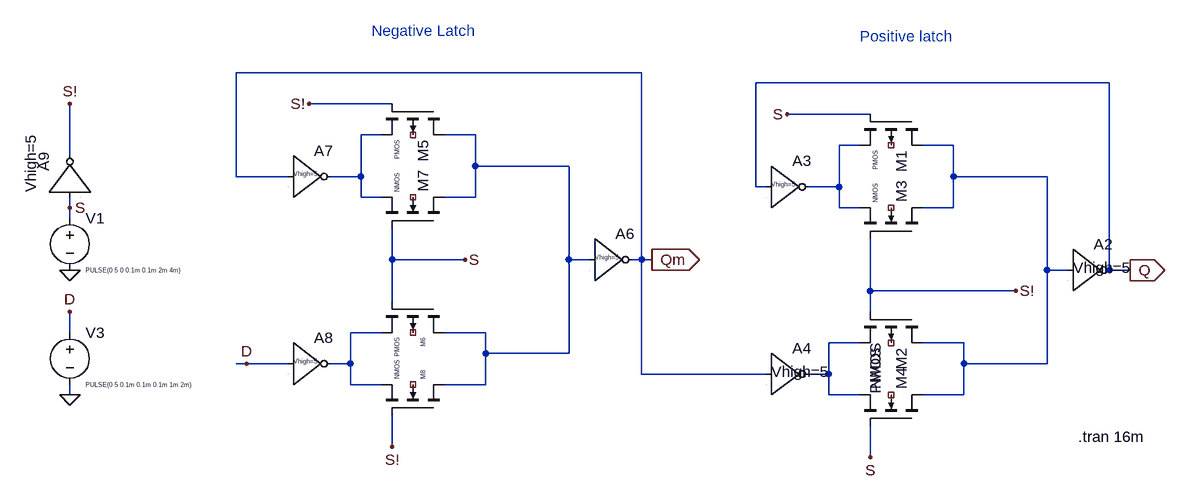
[diagram p0: schematic master_slave_rn.asc]
master_slave_rn.asc, the LTspice schematic file:
Version 4
SHEET 1 2536 680
WIRE 1040 -192 416 -192
WIRE 1760 -176 1216 -176
WIRE 656 -144 528 -144
WIRE 1392 -128 1264 -128
WIRE 640 -96 608 -96
WIRE 784 -96 736 -96
WIRE 1376 -80 1344 -80
WIRE 1520 -80 1472 -80
WIRE 160 -64 160 -144
WIRE 784 -48 784 -96
WIRE 928 -48 784 -48
WIRE 416 -32 416 -192
WIRE 496 -32 416 -32
WIRE 608 -32 608 -96
WIRE 608 -32 560 -32
WIRE 1520 -32 1520 -80
WIRE 1664 -32 1520 -32
WIRE 1216 -16 1216 -176
WIRE 1232 -16 1216 -16
WIRE 1344 -16 1344 -80
WIRE 1344 -16 1296 -16
WIRE 608 0 608 -32
WIRE 640 0 608 0
WIRE 784 0 784 -48
WIRE 784 0 736 0
WIRE 160 16 160 0
WIRE 1344 16 1344 -16
WIRE 1376 16 1344 16
WIRE 1520 16 1520 -32
WIRE 1520 16 1472 16
WIRE 160 32 160 16
WIRE 656 96 656 48
WIRE 768 96 656 96
WIRE 928 96 928 -48
WIRE 960 96 928 96
WIRE 1040 96 1040 -192
WIRE 1040 96 1024 96
WIRE 1056 96 1040 96
WIRE 1664 112 1664 -32
WIRE 1696 112 1664 112
WIRE 1760 112 1760 -176
WIRE 1792 112 1760 112
WIRE 1392 144 1392 64
WIRE 1616 144 1392 144
WIRE 656 160 656 96
WIRE 1392 176 1392 144
WIRE 160 208 160 176
WIRE 640 208 592 208
WIRE 800 208 736 208
WIRE 1376 224 1328 224
WIRE 1536 224 1472 224
WIRE 800 240 800 208
WIRE 928 240 928 96
WIRE 928 240 800 240
WIRE 432 256 416 256
WIRE 496 256 432 256
WIRE 592 256 592 208
WIRE 592 256 560 256
WIRE 1536 256 1536 224
WIRE 1664 256 1664 112
WIRE 1664 256 1536 256
WIRE 1040 272 1040 96
WIRE 1232 272 1040 272
WIRE 1328 272 1328 224
WIRE 1328 272 1296 272
WIRE 592 288 592 256
WIRE 640 288 592 288
WIRE 800 288 800 240
WIRE 800 288 736 288
WIRE 160 304 160 288
WIRE 1328 304 1328 272
WIRE 1376 304 1328 304
WIRE 1536 304 1536 256
WIRE 1536 304 1472 304
WIRE 656 384 656 336
WIRE 1392 400 1392 352
FLAG 160 176 D
FLAG 160 304 0
FLAG 160 112 0
FLAG 1792 112 Q
IOPIN 1792 112 Out
FLAG 1056 96 Qm
IOPIN 1056 96 Out
FLAG 160 -144 S!
FLAG 160 16 S
FLAG 528 -144 S!
FLAG 656 384 S!
FLAG 1616 144 S!
FLAG 768 96 S
FLAG 1264 -128 S
FLAG 1392 400 S
FLAG 432 256 D
SYMBOL pmos4 1472 -128 R90
WINDOW 3 56 72 Left 0
SYMATTR InstName M1
SYMBOL pmos4 1472 176 R90
SYMATTR InstName M2
SYMBOL nmos4 1472 64 M270
WINDOW 3 56 72 Left 0
SYMATTR InstName M3
SYMBOL nmos4 1472 352 M270
SYMATTR InstName M4
SYMBOL voltage 160 16 R0
WINDOW 3 24 96 Left 0
WINDOW 123 0 0 Left 0
WINDOW 39 0 0 Left 0
SYMATTR Value PULSE(0 5 0 0.1m 0.1m 2m 4m)
SYMATTR InstName V1
SYMBOL voltage 160 192 R0
WINDOW 3 24 96 Left 0
WINDOW 123 0 0 Left 0
WINDOW 39 0 0 Left 0
SYMATTR Value PULSE(0 5 0.1m 0.1m 0.1m 1m 2m)
SYMATTR InstName V3
SYMBOL Digital\\inv 1696 48 R0
WINDOW 3 8 60 Left 2
SYMATTR Value Vhigh=5
SYMATTR InstName A2
SYMBOL Digital\\inv 1232 -80 R0
WINDOW 3 8 60 Left 0
SYMATTR Value Vhigh=5
SYMATTR InstName A3
SYMBOL Digital\\inv 1232 208 R0
WINDOW 3 8 60 Left 2
SYMATTR Value Vhigh=5
SYMATTR InstName A4
SYMBOL pmos4 736 -144 R90
WINDOW 3 56 72 Left 0
SYMATTR InstName M5
SYMBOL pmos4 736 160 R90
WINDOW 0 56 32 Left 0
WINDOW 3 56 72 Left 0
SYMATTR InstName M6
SYMBOL nmos4 736 48 M270
WINDOW 3 56 72 Left 0
SYMATTR InstName M7
SYMBOL nmos4 736 336 M270
WINDOW 0 56 32 Left 0
WINDOW 3 56 72 Left 0
SYMATTR InstName M8
SYMBOL Digital\\inv 960 32 R0
WINDOW 3 8 60 Left 0
SYMATTR Value Vhigh=5
SYMATTR InstName A6
SYMBOL Digital\\inv 496 -96 R0
WINDOW 3 8 60 Left 0
SYMATTR Value Vhigh=5
SYMATTR InstName A7
SYMBOL Digital\\inv 496 192 R0
WINDOW 3 8 60 Left 0
SYMATTR Value Vhigh=5
SYMATTR InstName A8
SYMBOL Digital\\inv 96 0 R270
WINDOW 3 8 4 Left 2
SYMATTR Value Vhigh=5
SYMATTR InstName A9
TEXT 1712 368 Left 2 !.tran 16m
TEXT 624 -256 Left 2 ;Negative Latch
TEXT 1376 -248 Left 2 ;Positive latch

The netlist it stands for:
* master_slave_rn.asc
M1 N004 S N003 NC_01 PMOS
M2 N004 S! N006 NC_02 PMOS
M3 N004 S! N003 NC_03 NMOS
M4 N004 S N006 NC_04 NMOS
V1 S 0 PULSE(0 5 0 0.1m 0.1m 2m 4m)
V3 D 0 PULSE(0 5 0.1m 0.1m 0.1m 1m 2m)
A2 N004 0 0 0 0 Q 0 0 BUF Vhigh=5
A3 Q 0 0 0 0 N003 0 0 BUF Vhigh=5
A4 Qm 0 0 0 0 N006 0 0 BUF Vhigh=5
M5 N002 S! N001 NC_05 PMOS
M6 N002 S N005 NC_06 PMOS
M7 N002 S N001 NC_07 NMOS
M8 N002 S! N005 NC_08 NMOS
A6 N002 0 0 0 0 Qm 0 0 BUF Vhigh=5
A7 Qm 0 0 0 0 N001 0 0 BUF Vhigh=5
A8 D 0 0 0 0 N005 0 0 BUF Vhigh=5
A9 S 0 0 0 0 S! 0 0 BUF Vhigh=5
.model NMOS NMOS
.model PMOS PMOS
.lib standard.mos
.tran 16m
* Negative Latch
* Positive latch
.backanno
.end